# EAGLE design INTech - Carte de Base (EAGLE 6.3)
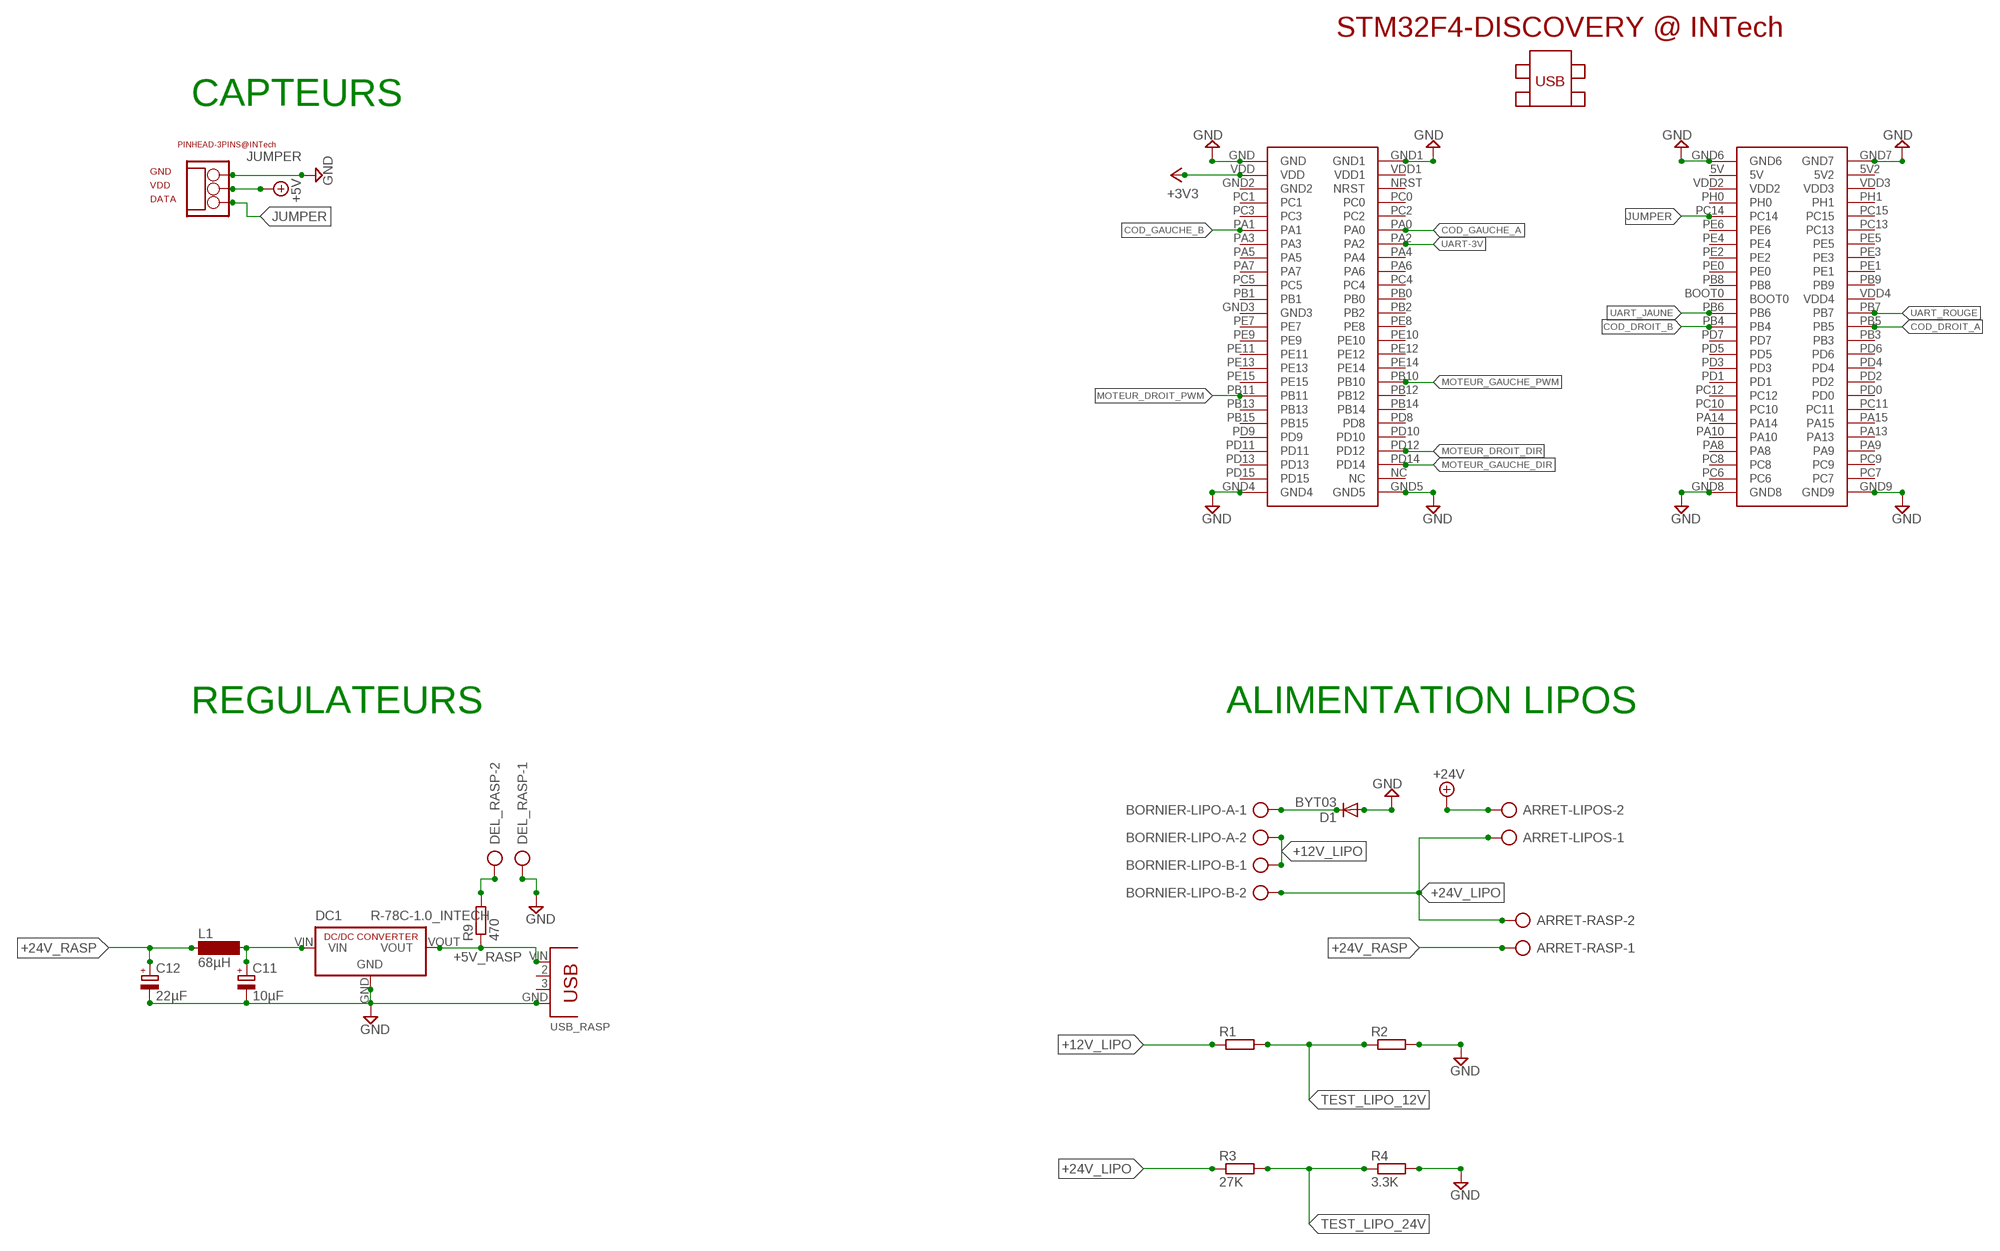
[diagram p0: schematic, sheet 1, part 1 of 2]
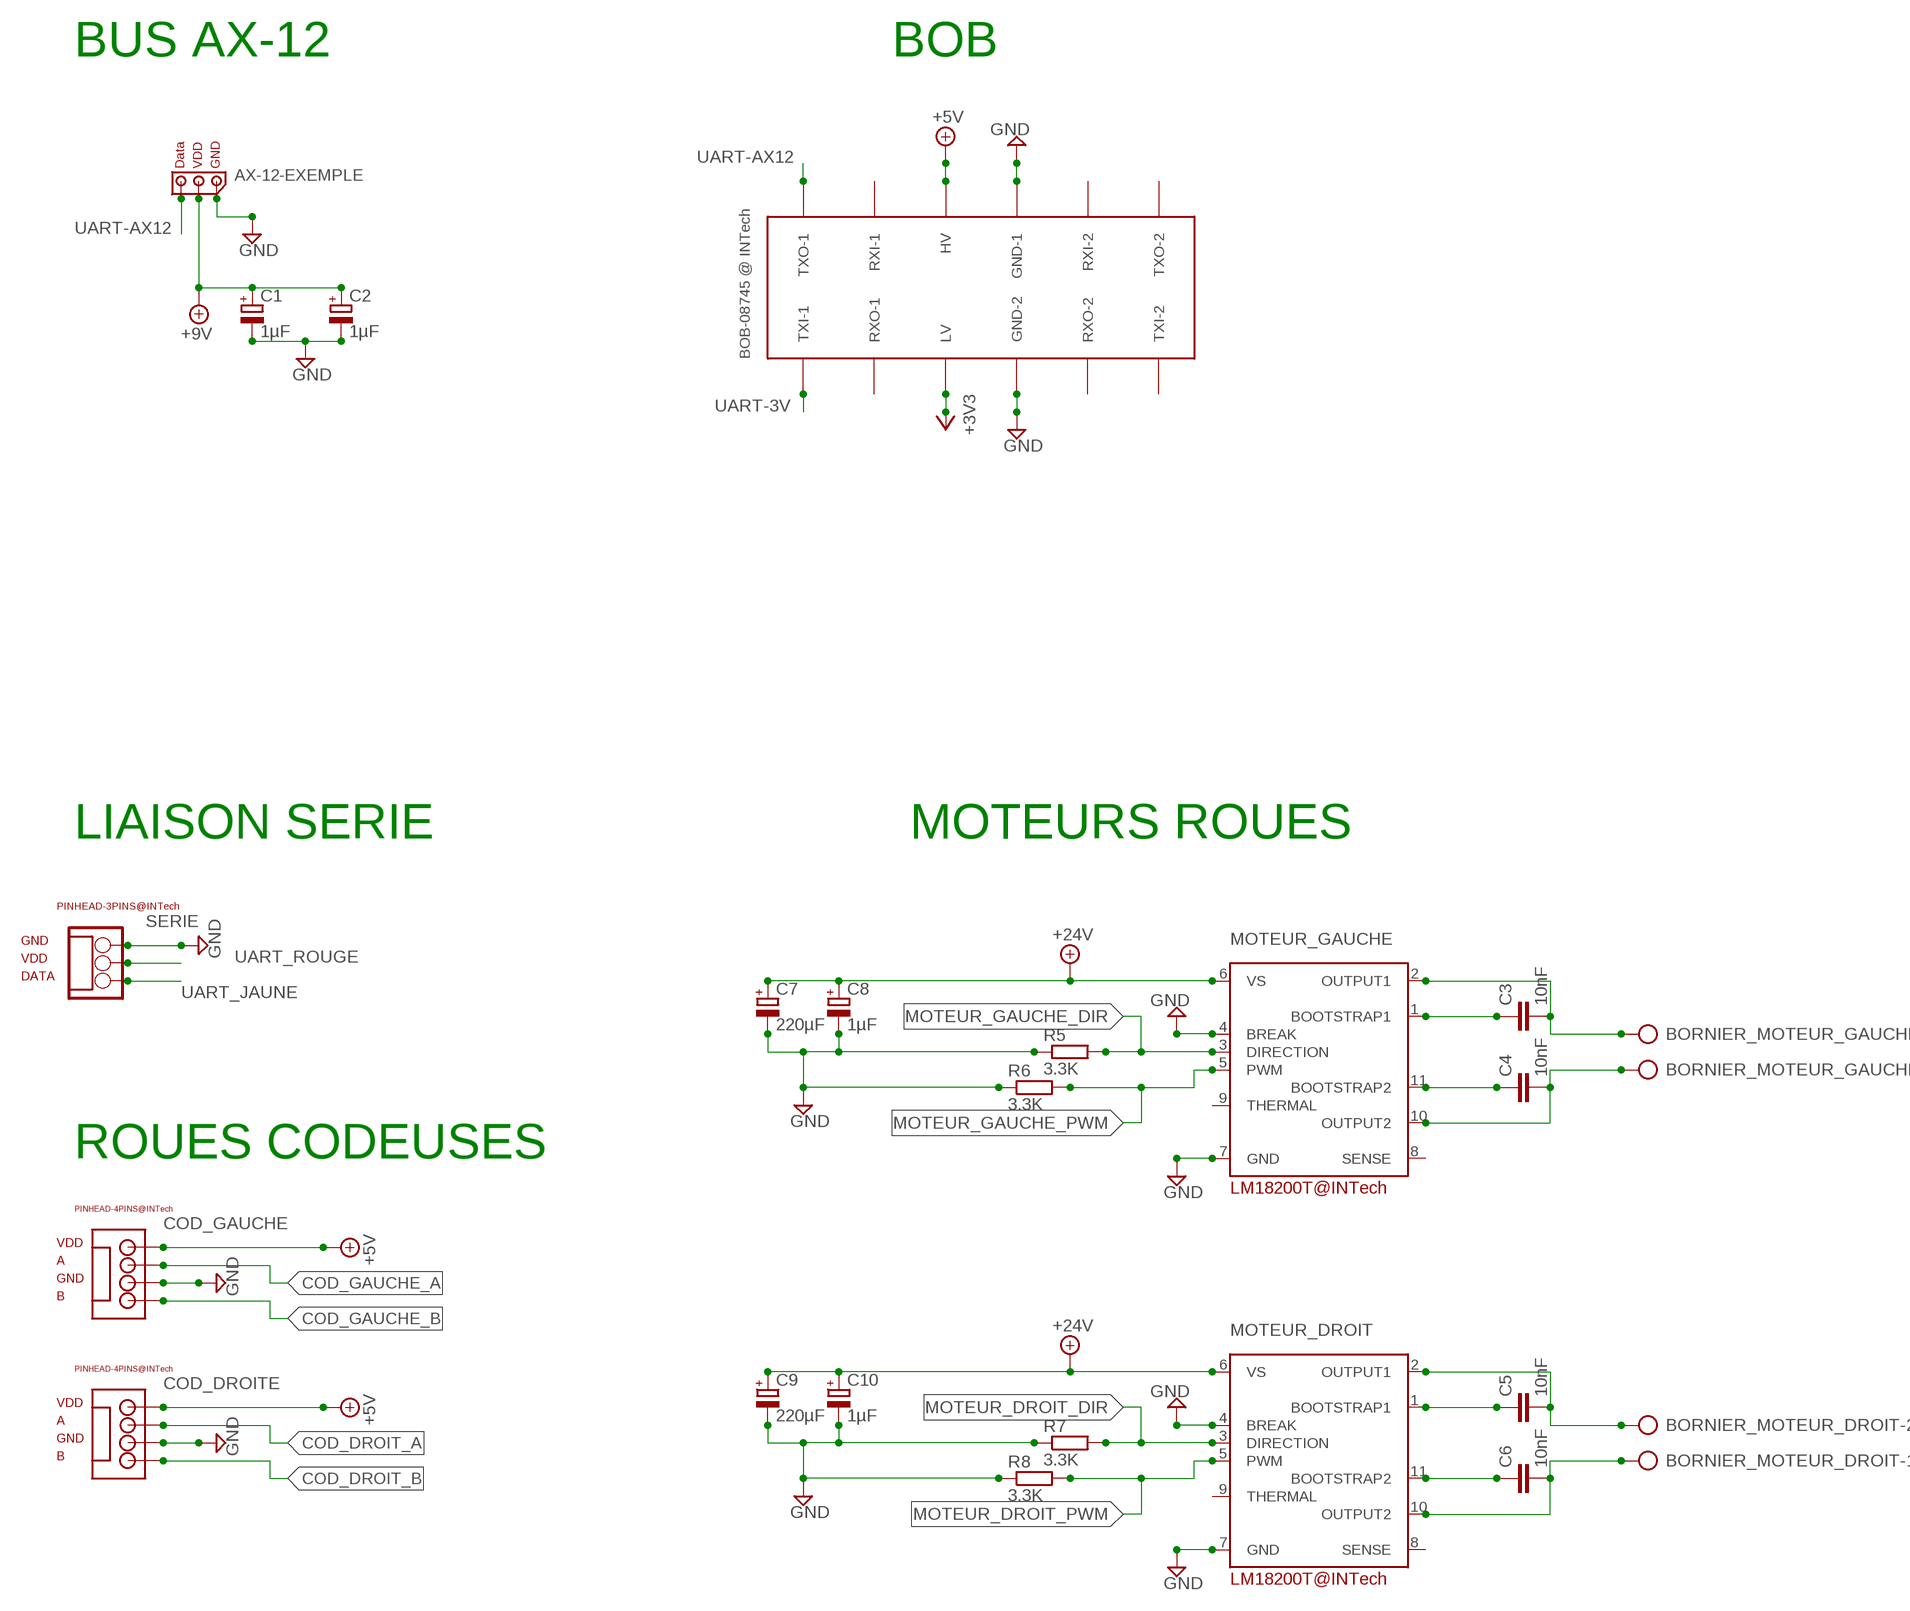
[diagram p1: schematic, sheet 1, part 2 of 2]

## Parts
ARRET-LIPOS  AK300/2  [AK300/2]
ARRET-RASP  AK300/2  [AK300/2]
AX-12-EXEMPLE  AX-12_CF_INTECH  [AX-12_CF_INTECH]
BORNIER-LIPO-A  AK300/2  [AK300/2]
BORNIER-LIPO-B  AK300/2  [AK300/2]
BORNIER_MOTEUR_DROIT  AK300/2  [AK300/2]
BORNIER_MOTEUR_GAUCHE  AK300/2  [AK300/2]
C1  1µF  CPOL-EUE2,5-6E  [E2,5-6E]
C2  1µF  CPOL-EUE2,5-6E  [E2,5-6E]
C3  10nF  C-EU050-025X075  [C050-025X075]
C4  10nF  C-EU050-025X075  [C050-025X075]
C5  10nF  C-EU050-025X075  [C050-025X075]
C6  10nF  C-EU050-025X075  [C050-025X075]
C7  220µF  CPOL-EUE3.5-8  [E3,5-8]
C8  1µF  CPOL-EUE3.5-8  [E3,5-8]
C9  220µF  CPOL-EUE3.5-8  [E3,5-8]
C10  1µF  CPOL-EUE3.5-8  [E3,5-8]
C11  10µF  CPOL-EUE2.5-6  [E2,5-6]
C12  22µF  CPOL-EUE2.5-6  [E2,5-6]
COD_DROITE  PINHEAD-4_CF_INTECH  [PINHEAD-4_CF_INTECH]
COD_GAUCHE  PINHEAD-4_CF_INTECH  [PINHEAD-4_CF_INTECH]
D1  BYT03  [DO27-15]
DC1  R-78C-1.0_INTECH  [SIP3_INTECH]
DEL_RASP  AK300/2  [AK300/2]
JUMPER  PINHEAD_CF_INTECH  [PINHEAD_CF_INTECH]
L1  68µH  SD12K100  [SD12K100]
MOTEUR_DROIT  LM18200T_CF_INTECH  [LM18200T_CF_INTECH]
MOTEUR_GAUCHE  LM18200T_CF_INTECH  [LM18200T_CF_INTECH]
R1  R-EU_0207/10  [0207/10]
R2  R-EU_0207/10  [0207/10]
R3  27K  R-EU_0207/10  [0207/10]
R4  3.3K  R-EU_0207/10  [0207/10]
R5  3.3K  R-EU_0207/10  [0207/10]
R6  3.3K  R-EU_0207/10  [0207/10]
R7  3.3K  R-EU_0207/10  [0207/10]
R8  3.3K  R-EU_0207/10  [0207/10]
R9  470  R-EU_0204/7  [0204/7]
SERIE  PINHEAD_CF_INTECH  [PINHEAD_CF_INTECH]
U$1  STM32F4-DISCOVERY  [STM32F4-DISCOVERY]
U$2  BOB-08745  [BOB-08745]
USB_RASP  USB_87520  [USB]

## Nets
+3V3: U$1.VDD U$2.LV
+5V: COD_DROITE.VDD COD_GAUCHE.VDD JUMPER.VDD U$2.HV
+5V_RASP: DC1.VOUT R9.1 USB_RASP.VIN
+9V: AX-12-EXEMPLE.VDD C1.+ C2.+
+12V_LIPO: BORNIER-LIPO-A.2 BORNIER-LIPO-B.1 R1.1
+24V: ARRET-LIPOS.2 C7.+ C8.+ C9.+ C10.+ MOTEUR_DROIT.6(VS) MOTEUR_GAUCHE.6(VS)
+24V_LIPO: ARRET-LIPOS.1 ARRET-RASP.2 BORNIER-LIPO-B.2 R3.1
+24V_RASP: ARRET-RASP.1 C12.+ L1.1
COD_DROIT_A: COD_DROITE.A U$1.PB5
COD_DROIT_B: COD_DROITE.B U$1.PB4
COD_GAUCHE_A: COD_GAUCHE.A U$1.PA0
COD_GAUCHE_B: COD_GAUCHE.B U$1.PA1
GND: AX-12-EXEMPLE.GND C1.- C2.- C7.- C8.- C9.- C10.- C11.- C12.- COD_DROITE.GND COD_GAUCHE.GND D1.A DC1.GND DEL_RASP.1 JUMPER.GND MOTEUR_DROIT.4(BREAK) MOTEUR_DROIT.7(GND) MOTEUR_GAUCHE.4(BREAK) MOTEUR_GAUCHE.7(GND) R2.2 R4.2 R5.1 R6.1 R7.1 R8.1 SERIE.GND U$1.GND U$1.GND1 U$1.GND4 U$1.GND5 U$1.GND6 U$1.GND7 U$1.GND8 U$1.GND9 U$2.GND-1 U$2.GND-2 USB_RASP.GND
JUMPER: JUMPER.DATA U$1.PC14
MOTEUR_DROIT_DIR: MOTEUR_DROIT.3(DIRECTION) R7.2 U$1.PD12
MOTEUR_DROIT_PWM: MOTEUR_DROIT.5(PWM) R8.2 U$1.PB11
MOTEUR_GAUCHE_DIR: MOTEUR_GAUCHE.3(DIRECTION) R5.2 U$1.PD14
MOTEUR_GAUCHE_PWM: MOTEUR_GAUCHE.5(PWM) R6.2 U$1.PB10
N$1: BORNIER-LIPO-A.1 D1.C
N$2: C4.1 MOTEUR_GAUCHE.11(BOOTSTRAP2)
N$3: C3.1 MOTEUR_GAUCHE.1(BOOTSTRAP1)
N$10: C5.1 MOTEUR_DROIT.1(BOOTSTRAP1)
N$11: C6.1 MOTEUR_DROIT.11(BOOTSTRAP2)
N$12: C11.+ DC1.VIN L1.2
N$16: DEL_RASP.2 R9.2
N$18: BORNIER_MOTEUR_GAUCHE.2 C3.2 MOTEUR_GAUCHE.2(OUTPUT1)
N$19: BORNIER_MOTEUR_GAUCHE.1 C4.2 MOTEUR_GAUCHE.10(OUTPUT2)
N$20: BORNIER_MOTEUR_DROIT.2 C5.2 MOTEUR_DROIT.2(OUTPUT1)
N$21: BORNIER_MOTEUR_DROIT.1 C6.2 MOTEUR_DROIT.10(OUTPUT2)
TEST_LIPO_12V: R1.2 R2.1
TEST_LIPO_24V: R3.2 R4.1
UART-3V: U$1.PA2 U$2.TXI-1
UART-AX12: AX-12-EXEMPLE.DATA U$2.TXO-1
UART_JAUNE: SERIE.DATA U$1.PB6
UART_ROUGE: SERIE.VDD U$1.PB7
Unconnected: MOTEUR_DROIT.8(SENSE) MOTEUR_DROIT.9(THERMAL) MOTEUR_GAUCHE.8(SENSE) MOTEUR_GAUCHE.9(THERMAL) U$1.5V U$1.5V2 U$1.BOOT0 U$1.GND2 U$1.GND3 U$1.NC U$1.NRST U$1.PA3 U$1.PA4 U$1.PA5 U$1.PA6 U$1.PA7 U$1.PA8 U$1.PA9 U$1.PA10 U$1.PA13 U$1.PA14 U$1.PA15 U$1.PB0 U$1.PB1 U$1.PB2 U$1.PB3 U$1.PB8 U$1.PB9 U$1.PB12 U$1.PB13 U$1.PB14 U$1.PB15 U$1.PC0 U$1.PC1 U$1.PC2 U$1.PC3 U$1.PC4 U$1.PC5 U$1.PC6 U$1.PC7 U$1.PC8 U$1.PC9 U$1.PC10 U$1.PC11 U$1.PC12 U$1.PC13 U$1.PC15 U$1.PD0 U$1.PD1 U$1.PD2 U$1.PD3 U$1.PD4 U$1.PD5 U$1.PD6 U$1.PD7 U$1.PD8 U$1.PD9 U$1.PD10 U$1.PD11 U$1.PD13 U$1.PD15 U$1.PE0 U$1.PE1 U$1.PE2 U$1.PE3 U$1.PE4 U$1.PE5 U$1.PE6 U$1.PE7 U$1.PE8 U$1.PE9 U$1.PE10 U$1.PE11 U$1.PE12 U$1.PE13 U$1.PE14 U$1.PE15 U$1.PH0 U$1.PH1 U$1.VDD1 U$1.VDD2 U$1.VDD3 U$1.VDD4 U$2.RXI-1 U$2.RXI-2 U$2.RXO-1 U$2.RXO-2 U$2.TXI-2 U$2.TXO-2 USB_RASP.2 USB_RASP.3

## Notes on the sheet
- CAPTEURS | BUS AX-12 | BOB
- REGULATEURS | ALIMENTATION LIPOS | LIAISON SERIE | MOTEURS ROUES
- ROUES CODEUSES

## Library data of the parts
ARRET-LIPOS ARRET-RASP BORNIER-LIPO-A BORNIER-LIPO-B BORNIER_MOTEUR_DROIT BORNIER_MOTEUR_GAUCHE DEL_RASP = con-ptr500:AK300/2: CONNECTOR; OC_FARNELL: unknown; OC_NEWARK: unknown
AX-12-EXEMPLE = AX-12_CF_INTech:AX-12_CF_INTECH
C1 C2 C7-C12 = resistor:CPOL-EU: POLARIZED CAPACITOR, European symbol
C3-C6 = resistor:C-EU: CAPACITOR, European symbol
COD_DROITE COD_GAUCHE = pinhead_CF_INTech:PINHEAD-4_CF_INTECH: Connecteurs 4 pins (codeuses)
D1 = diode:BYT03: DIODE ultra fast
DC1 = dc-dc-converter:R-78C*-1.0_INTECH
JUMPER SERIE = pinhead_CF_INTech:PINHEAD_CF_INTECH: Connecteur 3 pins (ultrasons, série...)
L1 = inductor-neosid:SD12: INDUCTOR nominal inductance; OC_FARNELL: unknown; OC_NEWARK: unknown
MOTEUR_DROIT MOTEUR_GAUCHE = LM18200T_CF_INTech:LM18200T_CF_INTECH: Pont en H pour le contrôle de moteurs
R1-R9 = resistor:R-EU_: RESISTOR, European symbol
U$1 = STM32F4-DISCOVERY_CF_INTECH:STM32F4-DISCOVERY
U$2 = BOB-08745_CF_INTech:BOB-08745: Convertisseur de niveau logique BOB-08745
USB_RASP = USB_CF_INTech:USB_87520: Connecteur pour alimentation USB-85720 (Raspberry...)

## Board
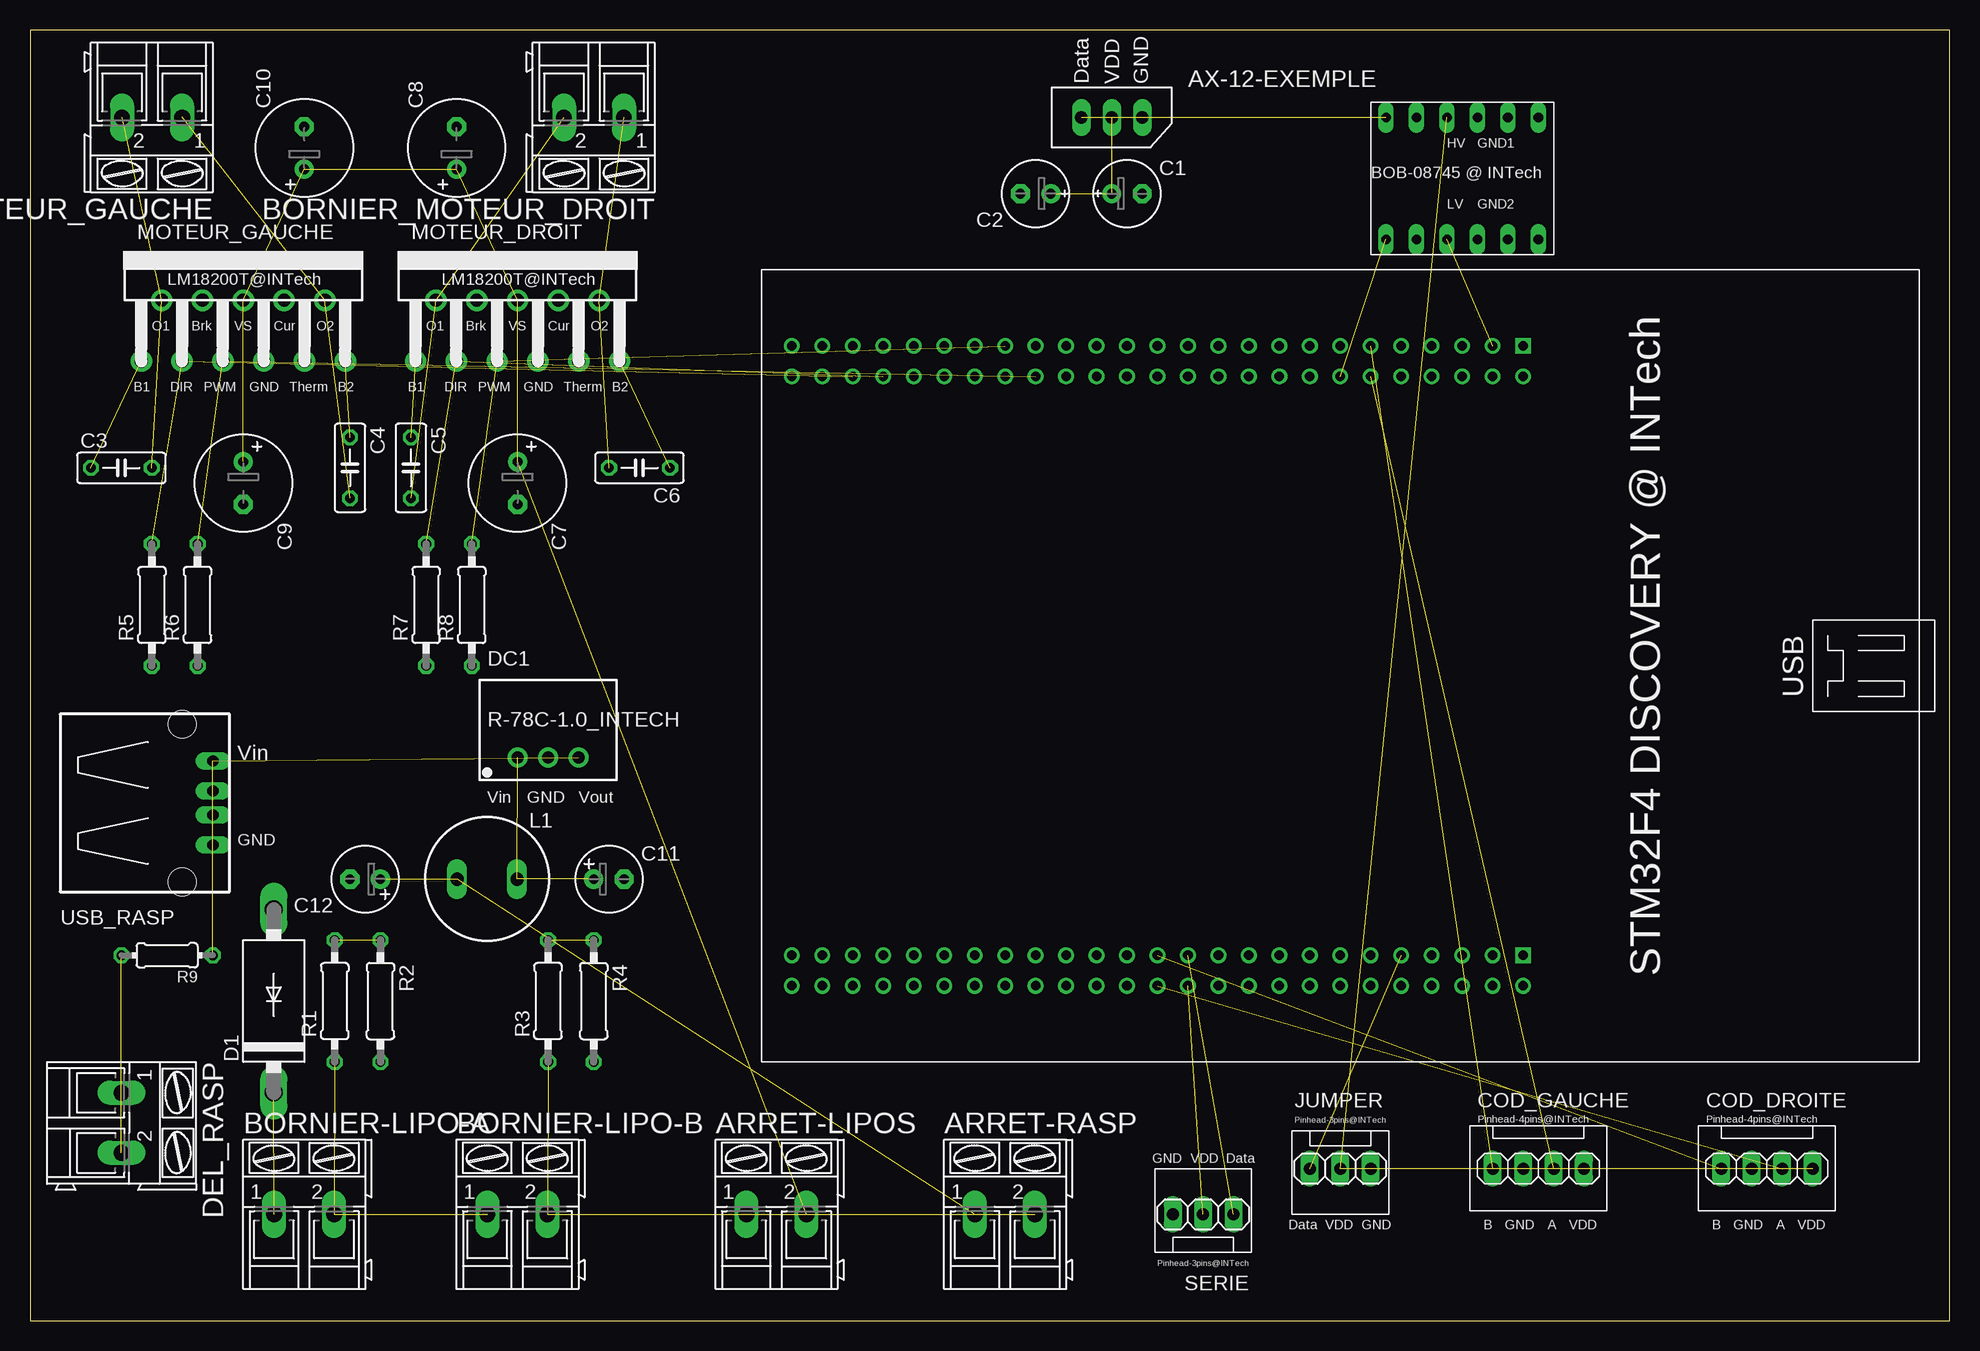
[diagram p2: board, top side]
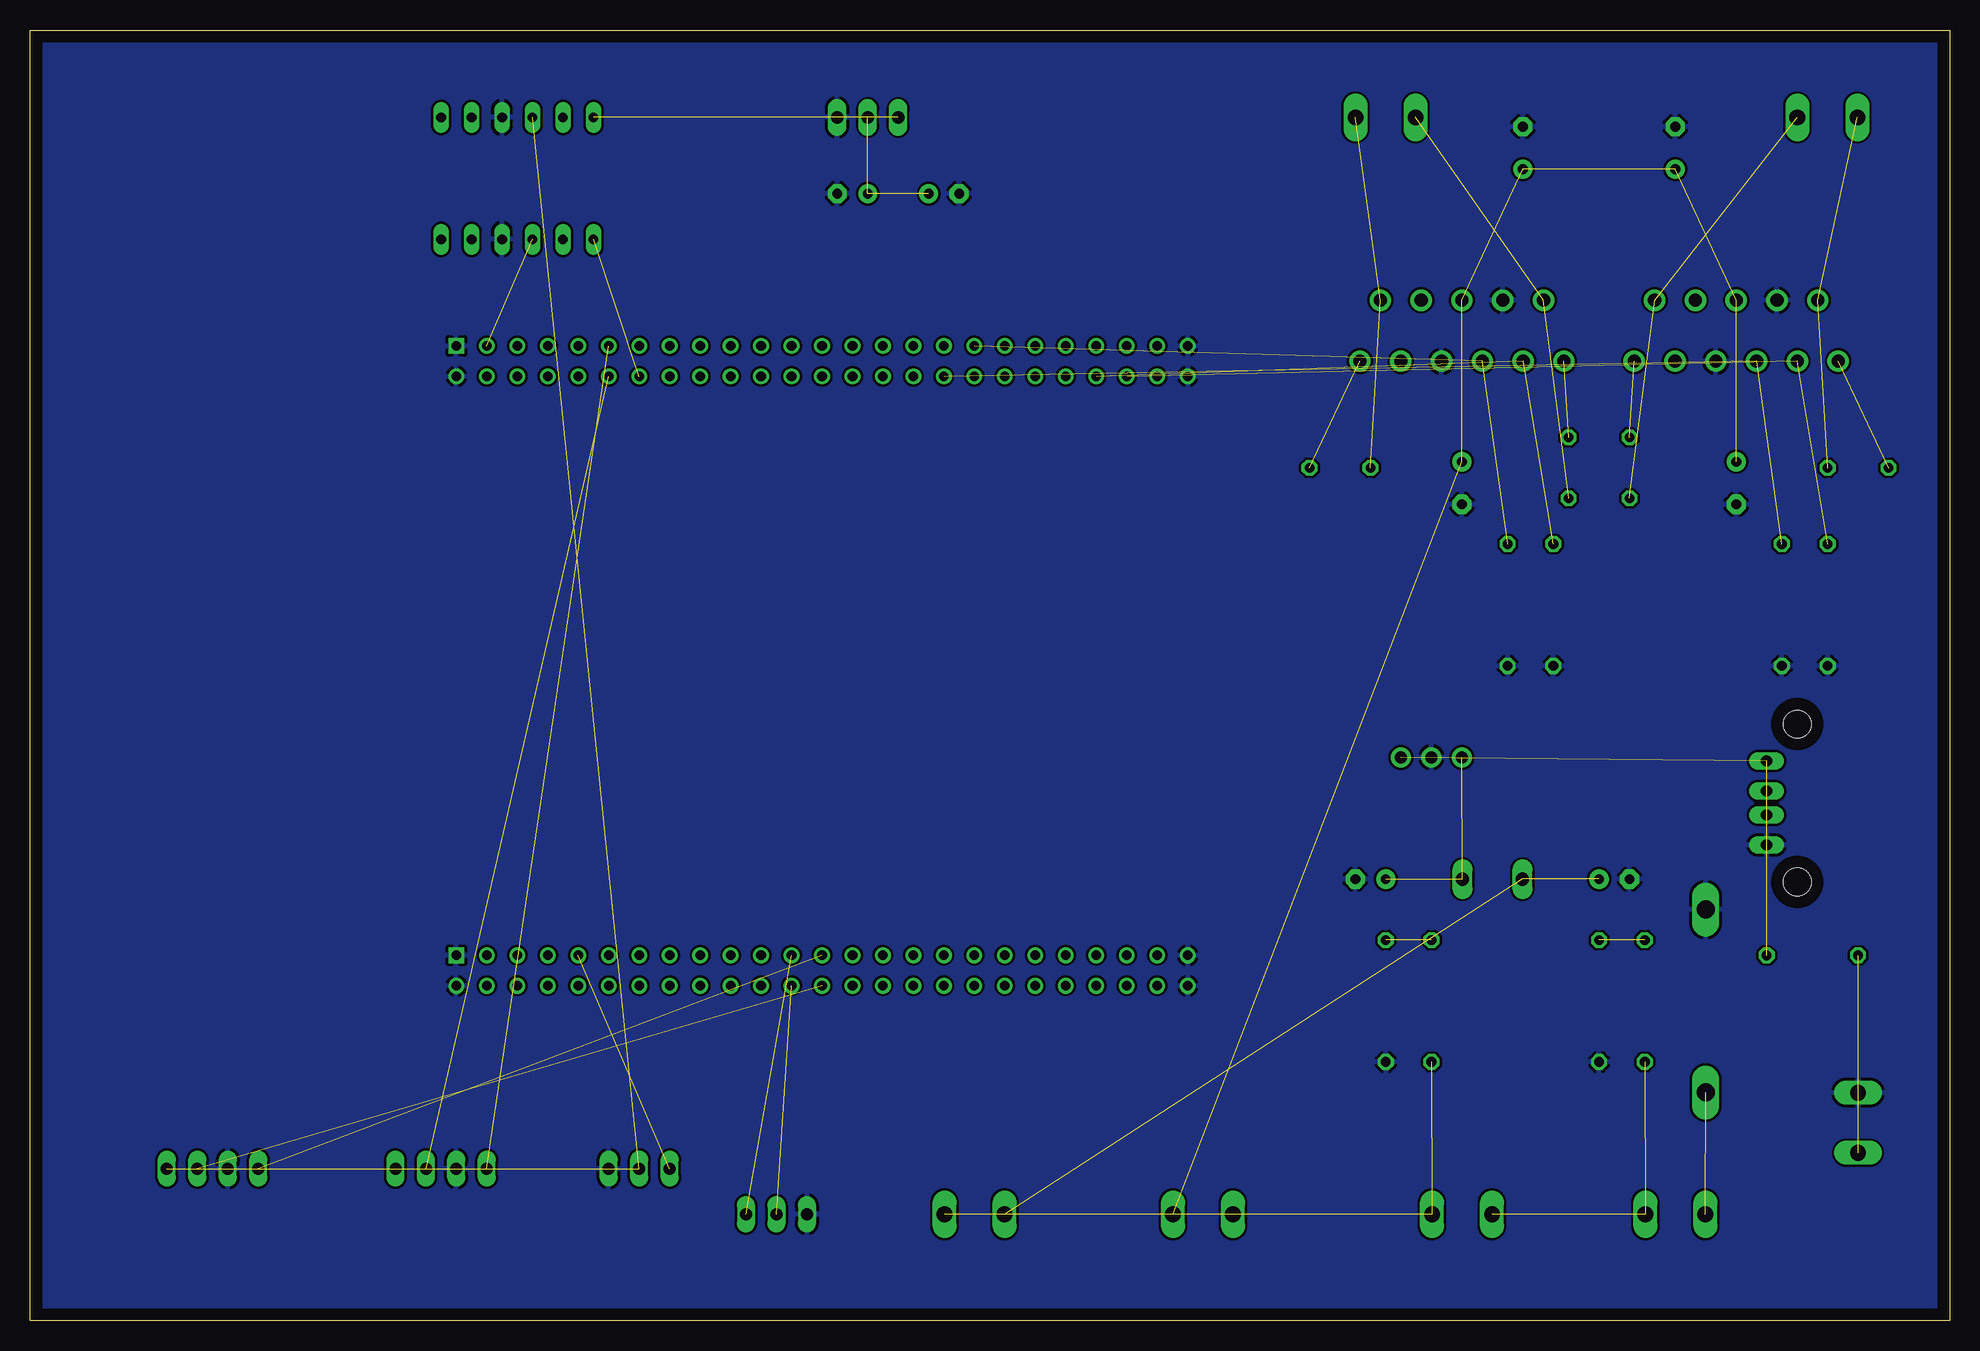
[diagram p3: board, bottom side, seen from below]

Size 160 x 107.62 mm. Coordinates in mm from the lower left corner, seen from the top.
Outline: 0,0 160,0 160,107.62 0,107.62 0,0
Copper layers (1*16): Top 0.035mm / dielectric 1.5mm / Bottom 0.035mm
Design rules "default": minimum track width 10mil, minimum drill 24mil, track to track 8mil, track to pad 8mil, pad to pad 8mil, via to via 8mil, smd to smd 8mil, copper to edge 40mil, drill to drill 8mil, minimum pad ring 10mil, minimum via ring 8mil, stop-mask expansion 4mil, vias tented up to drill 0mil, thermal gap 10mil

### Footprints (pad centres in the part's own frame; a part is rotated, then mirrored left to right if it is on the bottom)
AK300/2 = drill 1.321 long: 1 -2.515,0; 2 2.489,0
AX-12_CF_INTECH = drill 1.016 long: DATA -2.54,0; GND 2.54,0; VDD 0,0
E2,5-6E = drill 0.813 pad 1.575: + -1.27,0 | drill 0.813 pad 1.575 octagon: - 1.27,0
C050-025X075 = drill 0.813 octagon: 1 -2.54,0; 2 2.54,0
E3,5-8 = drill 0.813 pad 1.6: + -1.778,0 | drill 0.813 pad 1.6 octagon: - 1.778,0
E2,5-6 = drill 0.813 pad 1.6: + -1.27,0 | drill 0.813 pad 1.6 octagon: - 1.27,0
PINHEAD-4_CF_INTECH = drill 1 long: A 1.27,0; B -3.81,0; GND -1.27,0; VDD 3.81,0
DO27-15 = drill 1.499 long: A 7.62,0; C -7.62,0
SIP3_INTECH = drill 1 pad 1.676: GND 0,0; VIN -2.54,0; VOUT 2.54,0
PINHEAD_CF_INTECH = drill 1 long: DATA -2.54,0; GND 2.54,0; VDD 0,0
SD12K100 = drill 1.1 long: 1 -2.5,0; 2 2.5,0
LM18200T_CF_INTECH = drill 1.1 pad 1.778: 1 -8.5,-8.89; 2 -6.8,-3.81; 3 -5.1,-8.89; 4 -3.4,-3.81; 5 -1.7,-8.89; 6 0,-3.81; 7 1.7,-8.89; 8 3.4,-3.81; 9 5.1,-8.89; 10 6.8,-3.81; 11 8.5,-8.89
0207/10 = drill 0.813 octagon: 1 -5.08,0; 2 5.08,0
0204/7 = drill 0.813 octagon: 1 -3.81,0; 2 3.81,0
STM32F4-DISCOVERY = drill 0.8: 5V 24.13,12.7; 5V2 26.67,12.7; BOOT0 24.13,-10.16; GND1 -24.13,15.24; GND2 -26.67,10.16; GND3 -26.67,-12.7; GND4 -26.67,-45.72; GND5 -24.13,-45.72; GND7 26.67,15.24; GND8 24.13,-45.72; GND9 26.67,-45.72; NC -24.13,-43.18; NRST -24.13,10.16; PA0 -24.13,2.54; PA1 -26.67,2.54; PA2 -24.13,0; PA3 -26.67,0; PA4 -24.13,-2.54; PA5 -26.67,-2.54; PA6 -24.13,-5.08; PA7 -26.67,-5.08; PA8 24.13,-38.1; PA9 26.67,-38.1; PA10 24.13,-35.56; PA13 26.67,-35.56; PA14 24.13,-33.02; PA15 26.67,-33.02; PB0 -24.13,-10.16; PB1 -26.67,-10.16; PB2 -24.13,-12.7; PB3 26.67,-17.78; PB4 24.13,-15.24; PB5 26.67,-15.24; PB6 24.13,-12.7; PB7 26.67,-12.7; PB8 24.13,-7.62; PB9 26.67,-7.62; PB10 -24.13,-25.4; PB11 -26.67,-27.94; PB12 -24.13,-27.94; PB13 -26.67,-30.48; PB14 -24.13,-30.48; PB15 -26.67,-33.02; PC0 -24.13,7.62; PC1 -26.67,7.62; PC2 -24.13,5.08; PC3 -26.67,5.08; PC4 -24.13,-7.62; PC5 -26.67,-7.62; PC6 24.13,-43.18; PC7 26.67,-43.18; PC8 24.13,-40.64; PC9 26.67,-40.64; PC10 24.13,-30.48; PC11 26.67,-30.48; PC12 24.13,-27.94; PC13 26.67,2.54; PC14 24.13,5.08; PC15 26.67,5.08; PD0 26.67,-27.94; PD1 24.13,-25.4; PD2 26.67,-25.4; PD3 24.13,-22.86; PD4 26.67,-22.86; PD5 24.13,-20.32; PD6 26.67,-20.32; PD7 24.13,-17.78; PD8 -24.13,-33.02; PD9 -26.67,-35.56; PD10 -24.13,-35.56; PD11 -26.67,-38.1; PD12 -24.13,-38.1; PD13 -26.67,-40.64; PD14 -24.13,-40.64; PD15 -26.67,-43.18; PE0 24.13,-5.08; PE1 26.67,-5.08; PE2 24.13,-2.54; PE3 26.67,-2.54; PE4 24.13,0; PE5 26.67,0; PE6 24.13,2.54; PE7 -26.67,-15.24; PE8 -24.13,-15.24; PE9 -26.67,-17.78; PE10 -24.13,-17.78; PE11 -26.67,-20.32; PE12 -24.13,-20.32; PE13 -26.67,-22.86; PE14 -24.13,-22.86; PE15 -26.67,-25.4; PH0 24.13,7.62; PH1 26.67,7.62; VDD -26.67,12.7; VDD1 -24.13,12.7; VDD2 24.13,10.16; VDD3 26.67,10.16; VDD4 26.67,-10.16 | drill 0.8 square: GND -26.67,15.24; GND6 24.13,15.24
BOB-08745 = drill 0.8 long: GND-1 1.27,5.08; GND-2 1.27,-5.08; HV -1.27,5.08; LV -1.27,-5.08; RXI-1 -3.81,5.08; RXI-2 3.81,5.08; RXO-1 -3.81,-5.08; RXO-2 3.81,-5.08; TXI-1 -6.35,-5.08; TXI-2 6.35,-5.08; TXO-1 -6.35,5.08; TXO-2 6.35,5.08
USB = drill 0.95 long: 2 -1,2.54; 3 1,2.54; GND 3.5,2.54; VIN -3.5,2.54 | hole 2.3: -6.57,0; 6.57,0

### Placement (x,y rotation side)
ARRET-LIPOS  62.23,8.89 0 top
ARRET-RASP  81.28,8.89 0 top
AX-12-EXEMPLE  90.17,100.33 0 top
BORNIER-LIPO-A  22.86,8.89 0 top
BORNIER-LIPO-B  40.64,8.89 0 top
BORNIER_MOTEUR_DROIT  46.99,100.33 180 top
BORNIER_MOTEUR_GAUCHE  10.16,100.33 180 top
C1  91.44,93.98 0 top
C2  83.82,93.98 180 top
C3  7.62,71.12 0 top
C4  26.67,71.12 270 top
C5  31.75,71.12 270 top
C6  50.8,71.12 180 top
C7  40.64,69.85 270 top
C8  35.56,97.79 90 top
C9  17.78,69.85 270 top
C10  22.86,97.79 90 top
C11  48.26,36.83 0 top
C12  27.94,36.83 180 top
COD_DROITE  144.78,12.7 0 top
COD_GAUCHE  125.73,12.7 0 top
D1  20.32,26.67 90 top
DC1  43.18,46.99 0 top
DEL_RASP  7.62,16.51 270 top
JUMPER  109.22,12.7 0 top
L1  38.1,36.83 0 top
MOTEUR_DROIT  40.64,88.9 0 top
MOTEUR_GAUCHE  17.78,88.9 0 top
R1  25.4,26.67 90 top
R2  29.21,26.67 270 top
R3  43.18,26.67 90 top
R4  46.99,26.67 270 top
R5  10.16,59.69 90 top
R6  13.97,59.69 90 top
R7  33.02,59.69 90 top
R8  36.83,59.69 90 top
R9  11.43,30.48 180 top
SERIE  97.79,8.89 180 top
U$1  109.22,54.61 270 top
U$2  119.38,95.25 0 top
USB_RASP  12.7,43.18 270 top

### Tracks (layer width: path | path; a pad name or v marks a point on that pad's centre or on a via)
+3V3  (1 unrouted)
+5V  (3 unrouted)
+5V_RASP  (2 unrouted)
+9V  (2 unrouted)
+12V_LIPO  (2 unrouted)
+24V  (6 unrouted)
+24V_LIPO  (3 unrouted)
+24V_RASP  (2 unrouted)
COD_DROIT_A  (1 unrouted)
COD_DROIT_B  (1 unrouted)
COD_GAUCHE_A  (1 unrouted)
COD_GAUCHE_B  (1 unrouted)
GND
  pour Bottom: 0,110.49 162.56,110.49 161.29,-3.81 -1.27,-3.81
JUMPER  (1 unrouted)
MOTEUR_DROIT_DIR  (2 unrouted)
MOTEUR_DROIT_PWM  (2 unrouted)
MOTEUR_GAUCHE_DIR  (2 unrouted)
MOTEUR_GAUCHE_PWM  (2 unrouted)
N$1  (1 unrouted)
N$2  (1 unrouted)
N$3  (1 unrouted)
N$10  (1 unrouted)
N$11  (1 unrouted)
N$12  (2 unrouted)
N$16  (1 unrouted)
N$18  (2 unrouted)
N$19  (2 unrouted)
N$20  (2 unrouted)
N$21  (2 unrouted)
TEST_LIPO_12V  (1 unrouted)
TEST_LIPO_24V  (1 unrouted)
UART-3V  (1 unrouted)
UART-AX12  (1 unrouted)
UART_JAUNE  (1 unrouted)
UART_ROUGE  (1 unrouted)